# EAGLE design Main (EAGLE 9.5.2)
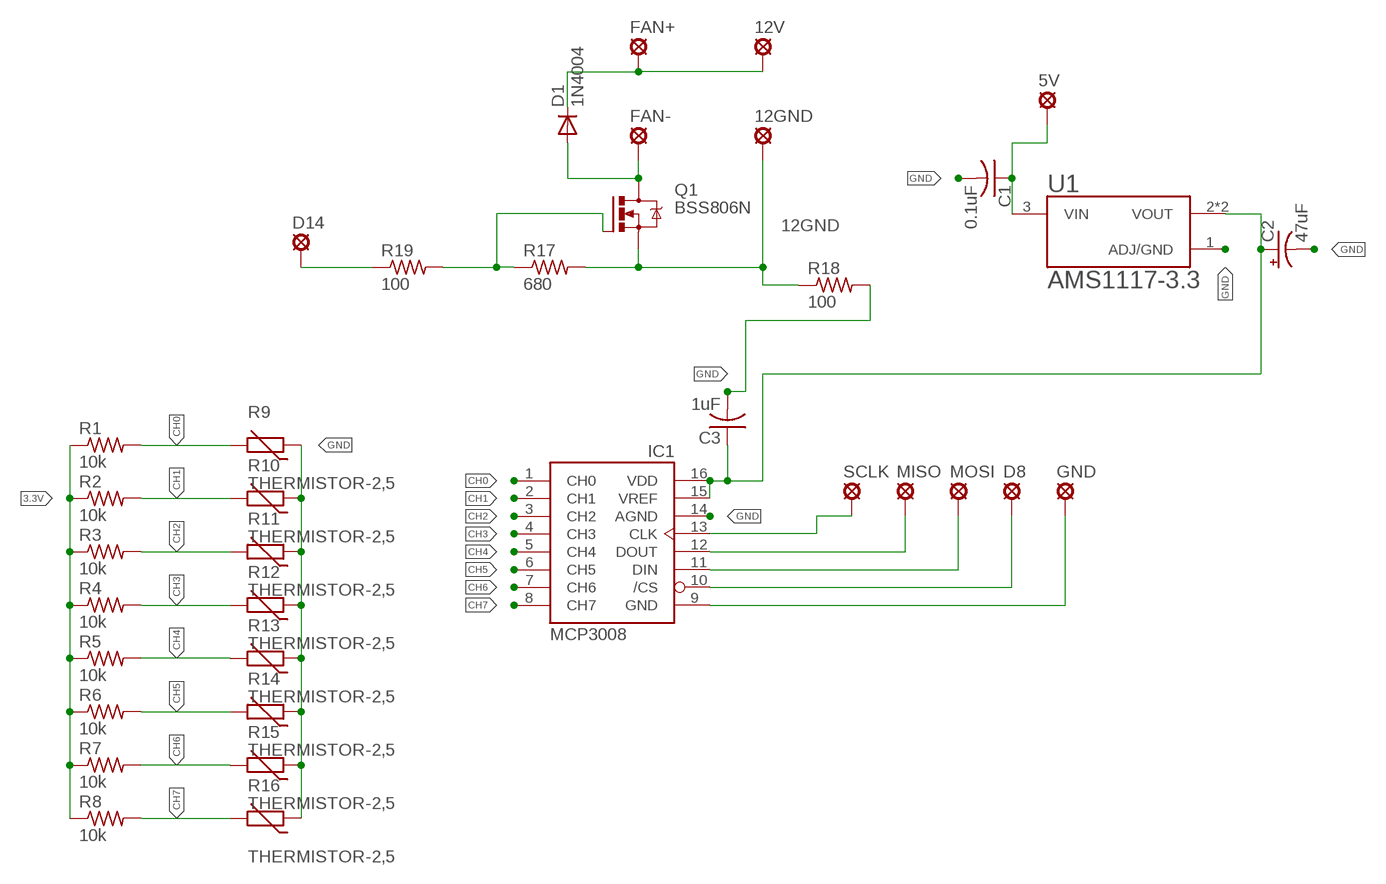
[diagram p0: schematic, sheet 1]

## Parts
5V  LSP10  [LSP10]
12GND  LSP10  [LSP10]
12V  LSP10  [LSP10]
C1  0.1uF  C-USC0805  [C0805]
C2  47uF  CPOL-USE2.5-6  [E2,5-6]
C3  1uF  C-USC0805  [C0805]
D1  1N4004  [DO41-10]
D8  LSP10  [LSP10]
D14  LSP10  [LSP10]
FAN+  LSP10  [LSP10]
FAN-  LSP10  [LSP10]
GND  LSP10  [LSP10]
IC1  MCP3008  [DIL16]
MISO  LSP10  [LSP10]
MOSI  LSP10  [LSP10]
Q1  BSS806N  NMOSFET_SOT23  [SOT23]
R1  10k  R-US_R0805  [R0805]
R2  10k  R-US_R0805  [R0805]
R3  10k  R-US_R0805  [R0805]
R4  10k  R-US_R0805  [R0805]
R5  10k  R-US_R0805  [R0805]
R6  10k  R-US_R0805  [R0805]
R7  10k  R-US_R0805  [R0805]
R8  10k  R-US_R0805  [R0805]
R9  THERMISTOR-2,5  [RS-2,5]
R10  THERMISTOR-2,5  [RS-2,5]
R11  THERMISTOR-2,5  [RS-2,5]
R12  THERMISTOR-2,5  [RS-2,5]
R13  THERMISTOR-2,5  [RS-2,5]
R14  THERMISTOR-2,5  [RS-2,5]
R15  THERMISTOR-2,5  [RS-2,5]
R16  THERMISTOR-2,5  [RS-2,5]
R17  680  R-US_R0805  [R0805]
R18  100  R-US_R0805  [R0805]
R19  100  R-US_R0805  [R0805]
SCLK  LSP10  [LSP10]
U1  AMS1117-3.3  [SOT229P700X180-4N]

## Nets
3.3V: C2.+ C3.1 IC1.15(VREF) IC1.16(VDD) R1.1 R2.1 R3.1 R4.1 R5.1 R6.1 R7.1 R8.1 U1.2(VOUT) U1.4(VOUT)
5V: 5V.MP C1.1 U1.3(VIN)
12GND: 12GND.MP Q1.2(S) R17.2 R18.1
CH0: IC1.1(CH0) R1.2 R9.2
CH1: IC1.2(CH1) R2.2 R10.2
CH2: IC1.3(CH2) R3.2 R11.2
CH3: IC1.4(CH3) R4.2 R12.2
CH4: IC1.5(CH4) R5.2 R13.2
CH5: IC1.6(CH5) R6.2 R14.2
CH6: IC1.7(CH6) R7.2 R15.2
CH7: IC1.8(CH7) R8.2 R16.2
D8: D8.MP IC1.10(/CS)
GND: C1.2 C2.- C3.2 GND.MP IC1.9(GND) IC1.14(AGND) R9.1 R10.1 R11.1 R12.1 R13.1 R14.1 R15.1 R16.1 R18.2 U1.1(ADJ/GND)
MISO: IC1.12(DOUT) MISO.MP
MOSI: IC1.11(DIN) MOSI.MP
N$1: 12V.MP D1.C FAN+.MP
N$2: D14.MP R19.1
N$3: D1.A FAN-.MP Q1.3(D)
N$7: Q1.1(G) R17.1 R19.2
SCLK: IC1.13(CLK) SCLK.MP

## Library data of the parts
5V 12GND 12V D8 D14 FAN+ FAN- GND MISO MOSI SCLK = solpad:LSP10: SOLDER PAD drill 1.0 mm, distributor Buerklin, 12H555
C1 C3 = rcl:C-US: CAPACITOR, American symbol; SPICEPREFIX: C
C2 = rcl:CPOL-US: POLARIZED CAPACITOR, American symbol; SPICEPREFIX: C
D1 = adafruit:1N4004: DIODE General purpose 1N400x type rectifier (With bigger pads) http://www.ladyada.net/library/pcb/eaglelibrary.html
IC1 = adafruit:MCP3008
Q1 = Transistor:NMOSFET: N-Channel MOSFET - Generic; CATEGORY: Transistor; SUB-CATEGORY: MOSFET; TYPE: N-Channel
R1-R8 R17-R19 = rcl:R-US_: RESISTOR, American symbol; SPICEPREFIX: R
R9-R16 = varistor:THERMISTOR: THERMISTOR
U1 = AMS1117-3.3:AMS1117-3.3: Sot223/Pkg 1-Amp 3.3-Volt Low Drop Out Voltage Regulatator; AVAILABILITY: Unavailable; DESCRIPTION: Sot223/Pkg 1-Amp 3.3-Volt Low Drop Out Voltage Regulatator; MF: Advanced Monolithic Systems; MP: AMS1117-3.3; PACKAGE: None; PRICE: None

## Board
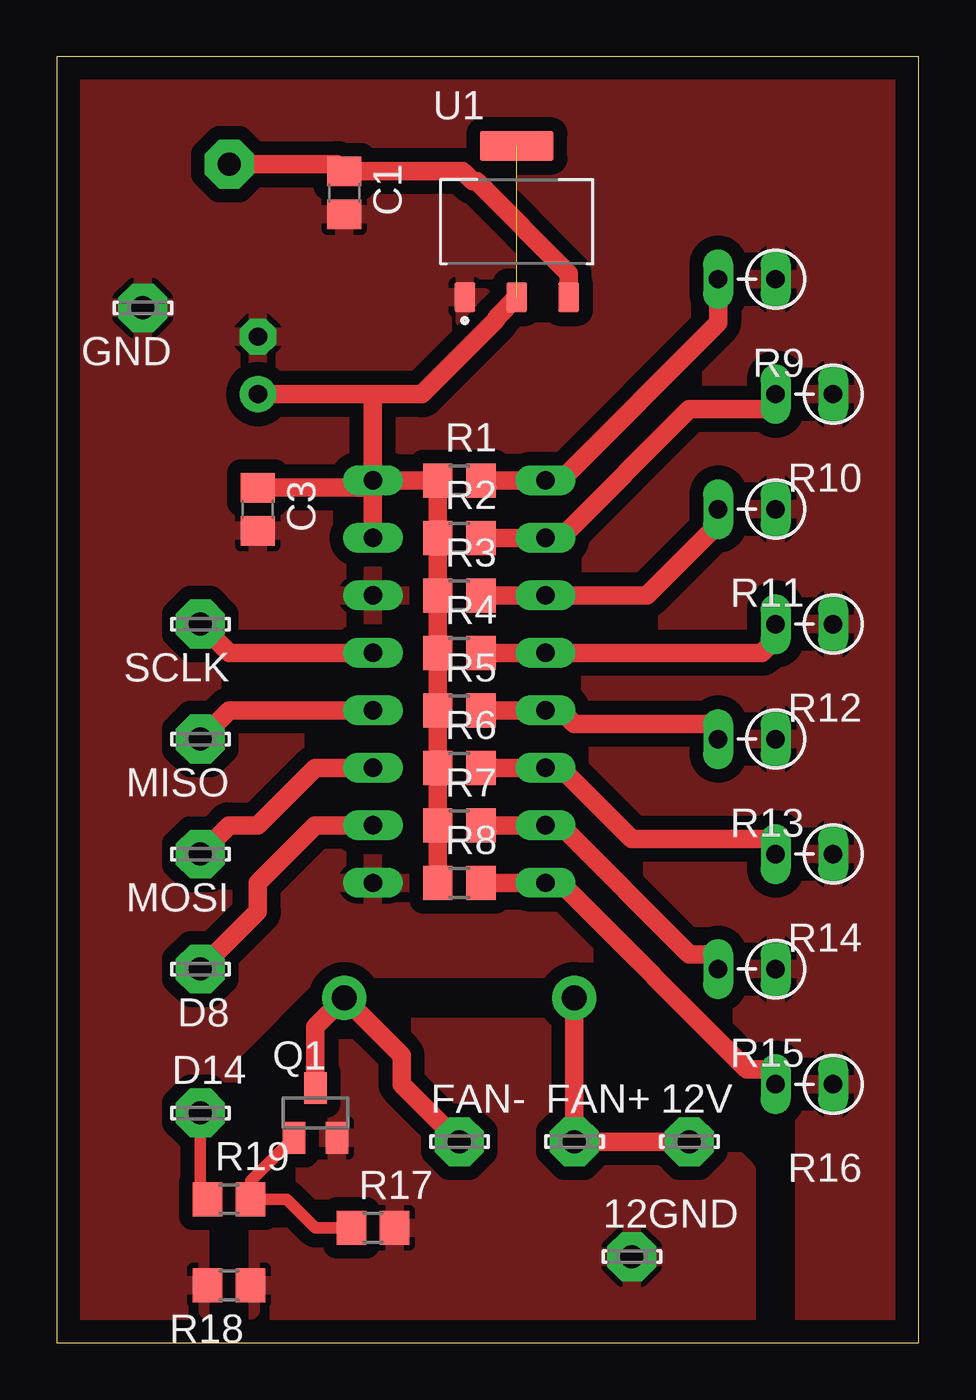
[diagram p1: board, top side]
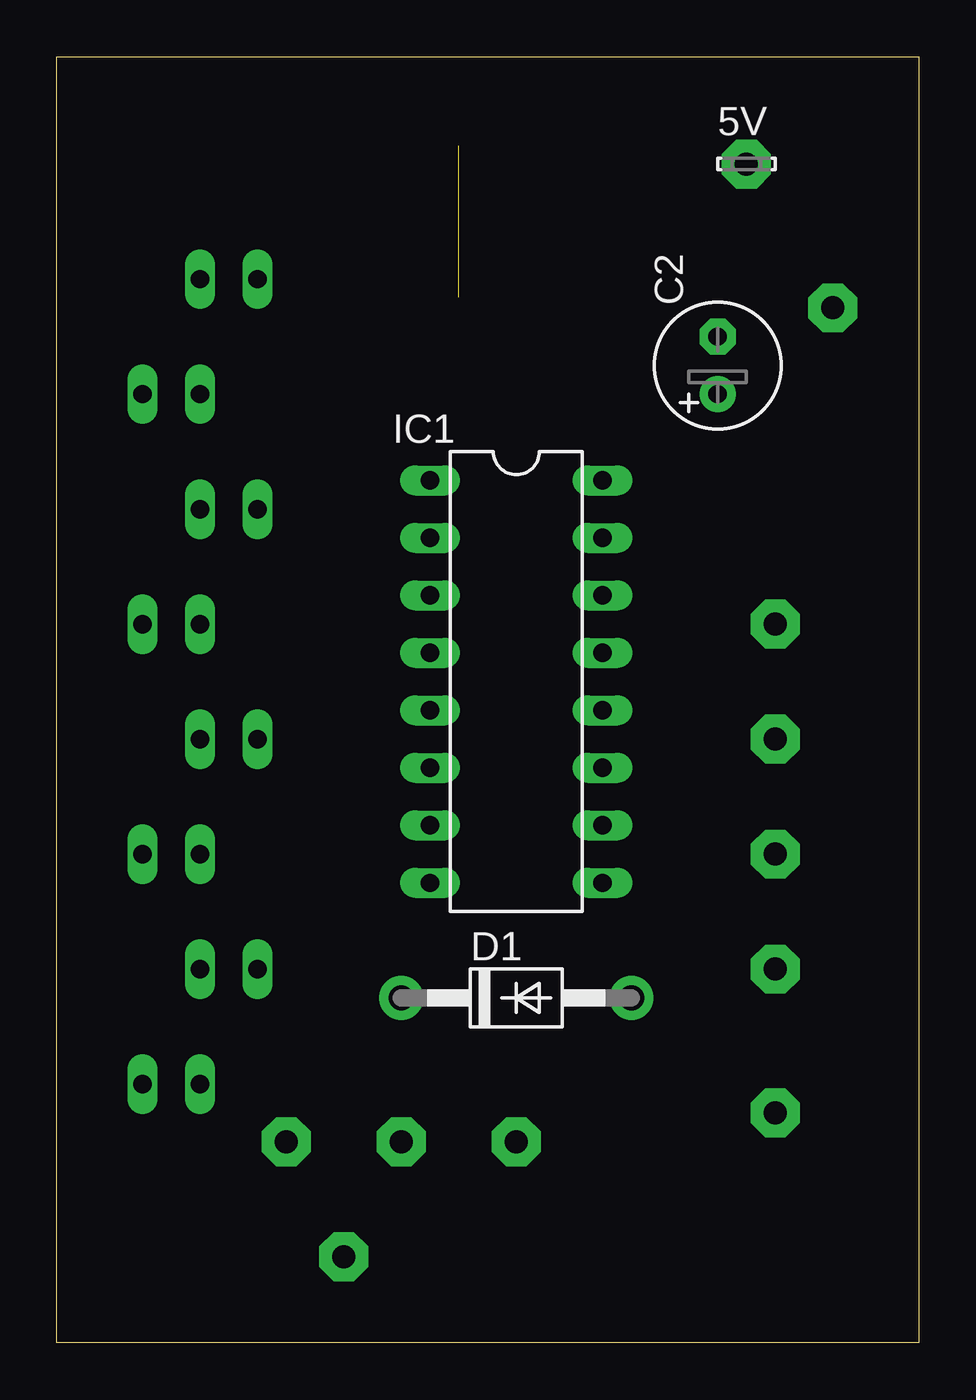
[diagram p2: board, bottom side, seen from below]

Size 38.08 x 56.82 mm. Coordinates in mm from the lower left corner, seen from the top.
Outline: 0,0 38.08,0 38.08,56.82 0,56.82 0,0
Copper layers 1: Top 0.035mm
Design rules "default *": minimum track width 20mil, minimum drill 0.35mm, track to track 20mil, track to pad 20mil, pad to pad 20mil, via to via 20mil, smd to smd 6mil, copper to edge 40mil, drill to drill 6mil, minimum pad ring 10mil, minimum via ring 8mil, stop-mask expansion 4mil, vias tented up to drill 0mil, thermal gap 10mil

### Footprints (pad centres in the part's own frame; a part is rotated, then mirrored left to right if it is on the bottom)
LSP10 = drill 1.016 pad 2.159 octagon: MP 0,0
C0805 = smd 1.3 x 1.5: 1 -0.95,0; 2 0.95,0
E2,5-6 = drill 0.813 pad 1.6: + -1.27,0 | drill 0.813 pad 1.6 octagon: - 1.27,0
DO41-10 = drill 1.118 pad 1.93: A 5.08,0; C -5.08,0
DIL16 = drill 0.813 long: 1 -8.89,-3.81; 2 -6.35,-3.81; 3 -3.81,-3.81; 4 -1.27,-3.81; 5 1.27,-3.81; 6 3.81,-3.81; 7 6.35,-3.81; 8 8.89,-3.81; 9 8.89,3.81; 10 6.35,3.81; 11 3.81,3.81; 12 1.27,3.81; 13 -1.27,3.81; 14 -3.81,3.81; 15 -6.35,3.81; 16 -8.89,3.81
SOT23 = smd 1 x 1.4: 1 -0.95,-1.1; 2 0.95,-1.1; 3 0,1.1
R0805 = smd 1.3 x 1.5: 1 -0.95,0; 2 0.95,0
RS-2,5 = drill 0.813 long: 1 -1.27,0; 2 1.27,0
SOT229P700X180-4N = smd 0.93 x 1.31: 1 -2.29,-3.345; 2 0,-3.345; 3 2.29,-3.345 | smd 3.24 x 1.31: 4 0,3.345

### Placement (x,y rotation side)
5V  7.62,52.07 0 bottom
12GND  25.4,3.81 0 top
12V  27.94,8.89 0 top
C1  12.7,50.8 270 top
C2  8.89,43.18 90 bottom
C3  8.89,36.83 270 top
D1  17.78,15.24 0 bottom
D8  6.35,16.51 180 top
D14  6.35,10.16 0 top
FAN+  22.86,8.89 0 top
FAN-  17.78,8.89 0 top
GND  3.81,45.72 180 top
IC1  17.78,29.21 270 bottom
MISO  6.35,26.67 180 top
MOSI  6.35,21.59 180 top
Q1  11.43,10.16 0 top
R1  17.78,38.1 0 top
R2  17.78,35.56 0 top
R3  17.78,33.02 0 top
R4  17.78,30.48 0 top
R5  17.78,27.94 0 top
R6  17.78,25.4 0 top
R7  17.78,22.86 0 top
R8  17.78,20.32 0 top
R9  30.48,46.99 180 top
R10  33.02,41.91 180 top
R11  30.48,36.83 180 top
R12  33.02,31.75 180 top
R13  30.48,26.67 180 top
R14  33.02,21.59 180 top
R15  30.48,16.51 180 top
R16  33.02,11.43 180 top
R17  13.97,5.08 0 top
R18  7.62,2.54 180 top
R19  7.62,6.35 0 top
SCLK  6.35,31.75 180 top
U1  20.32,49.53 0 top

### Tracks (layer width: path | path; a pad name or v marks a point on that pad's centre or on a via)
3.3V  (1 unrouted)
  Top 0.813: U1.2 19.41,45.27 19.41,45.19 16.13,41.91 13.97,41.91 | 13.97,41.91 C2.+ | IC1.16 13.97,41.91 | IC1.16 13.65,37.78 C3.1 | IC1.15 IC1.16 | IC1.16 R1.1 R2.1 R3.1 R4.1 R5.1 R6.1 R7.1 R8.1
5V
  Top 0.813: 5V.MP 12.38,52.07 C1.1 17.93,51.75 18.38,51.31 18.54,51.31 22.61,47.24 U1.3
12GND
  pour Top (isolate 0.61): 8.89,0 8.89,7.62 11.43,13.97 22.86,13.97 27.94,8.89 29.21,8.89 30.48,7.62 30.48,0
CH0
  Top 0.813: R9.2 29.21,46.33 29.21,45.06 22.25,38.1 IC1.1 20.93,38.1 R1.2
CH1
  Top 0.813: R2.2 20.93,35.56 IC1.2 22.25,35.56 27.94,41.25 31.75,41.25 R10.2
CH2
  Top 0.813: R11.2 29.21,36.17 26.06,33.02 22.25,33.02 IC1.3 20.93,33.02 R3.2
CH3
  Top 0.813: R12.2 31.75,31.09 31.14,30.48 22.25,30.48 IC1.4 20.93,30.48 R4.2
CH4
  Top 0.813: R13.2 29.21,27.33 22.86,27.33 22.25,27.94 IC1.5 20.93,27.94 R5.2
CH5
  Top 0.813: R14.2 31.75,22.25 25.4,22.25 22.25,25.4 IC1.6 20.93,25.4 R6.2
CH6
  Top 0.813: R15.2 29.21,17.17 27.94,17.17 22.25,22.86 IC1.7 20.93,22.86 R7.2
CH7
  Top 0.813: R16.2 31.75,12.09 30.48,12.09 22.25,20.32 IC1.8 20.93,20.32 R8.2
D8
  Top 0.813: D8.MP 8.89,19.05 8.89,20.32 11.43,22.86 IC1.10
GND
  pour Top (isolate 0.61): 0,0 0,57.15 38.1,57.15 38.1,0 33.02,0 33.02,10.16 31.75,11.43 24.13,11.43 24.13,16.51 11.43,16.51 7.62,12.7 7.62,10.16 6.35,8.89 6.35,0
MISO
  Top 0.813: MISO.MP 7.62,27.94 IC1.12
MOSI
  Top 0.813: MOSI.MP 7.62,22.86 8.89,22.86 11.43,25.4 IC1.11
N$1
  Top 0.813: D1.C FAN+.MP 12V.MP
N$2
  Top 0.508: R19.1 6.35,6.67 D14.MP
N$3
  Top 0.813: Q1.3 11.43,13.97 D1.A 15.24,12.7 15.24,11.43 FAN-.MP
N$7
  Top 0.508: Q1.1 8.57,7.15 R19.2 10.16,6.35 11.43,5.08 R17.1
SCLK
  Top 0.813: SCLK.MP 7.62,30.48 IC1.13